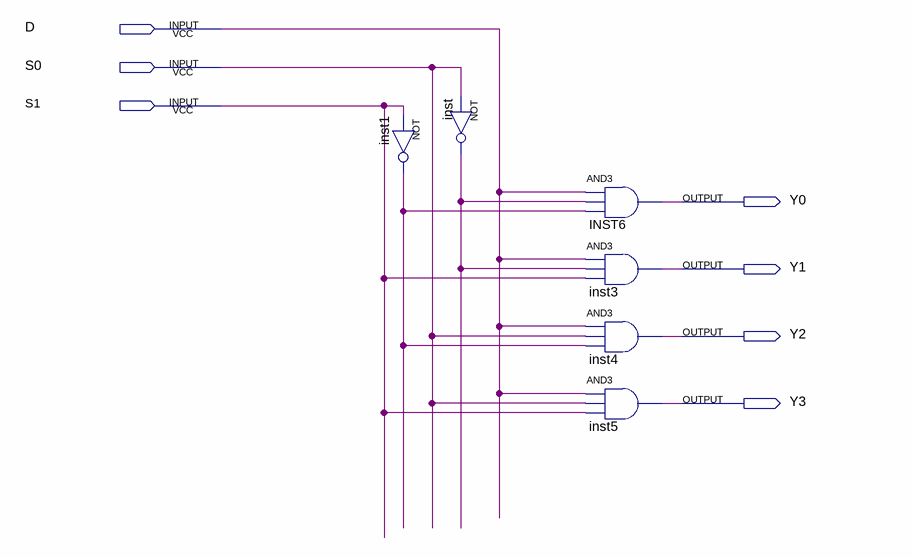
[diagram p0: schematic sheet]
// Quartus schematic DEM.bdf as structural Verilog: 6 symbols, 7 pins
module DEM (
  input  D,
  input  S0,
  input  S1,
  output Y0,
  output Y1,
  output Y2,
  output Y3
);

  wire inst1_out, inst_out;

  not inst1 (inst1_out, S1);
  not inst (inst_out, S0);
  and INST6 (Y0, D, inst_out, inst1_out);
  and inst3 (Y1, D, inst_out, S1);
  and inst4 (Y2, D, S0, inst1_out);
  and inst5 (Y3, D, S0, S1);
endmodule
